# EAGLE design LCD ctrl (EAGLE 9.2.2)

## Sheet 1 of 2
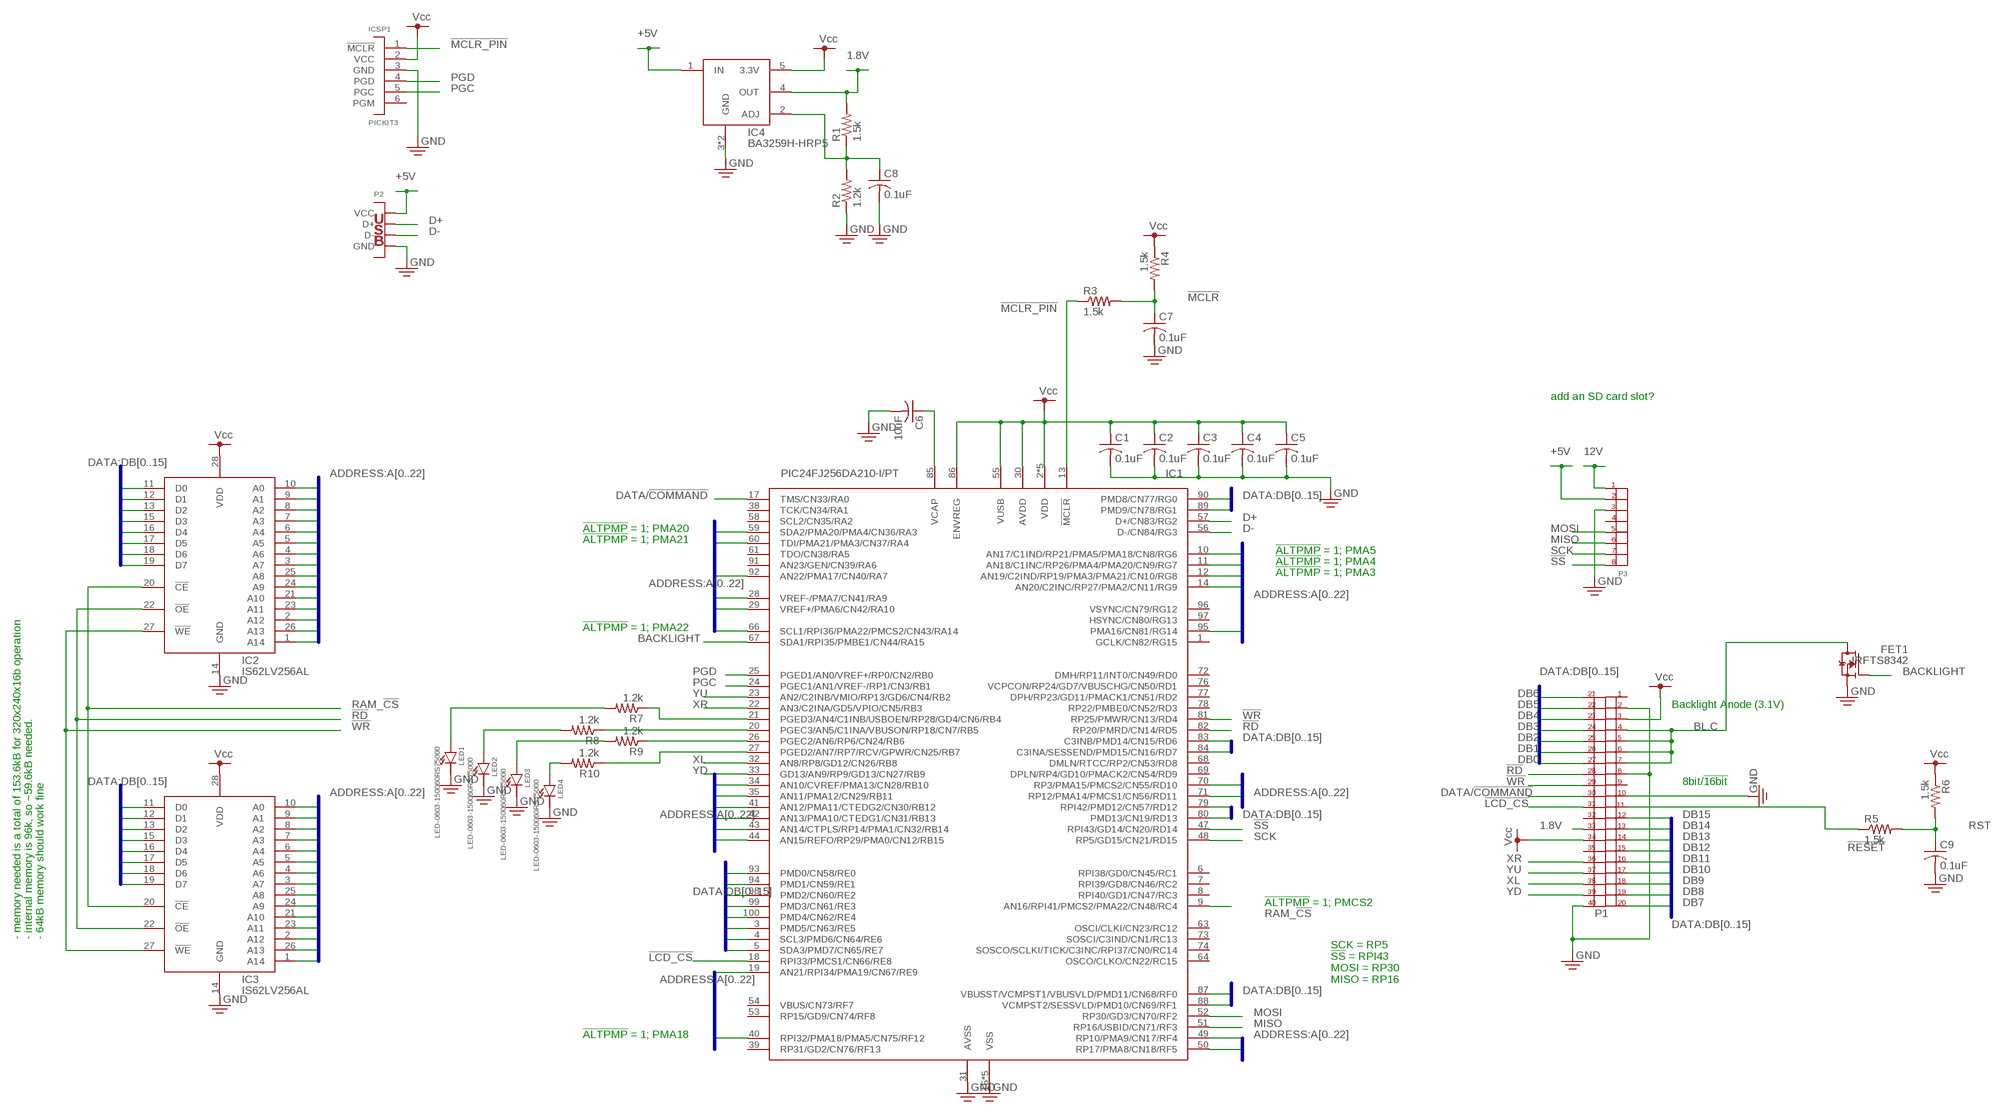
[diagram p0: schematic, sheet 1]

### Parts
C1  0.1uF  C-USC0603  [C0603]
C2  0.1uF  C-USC0603  [C0603]
C3  0.1uF  C-USC0603  [C0603]
C4  0.1uF  C-USC0603  [C0603]
C5  0.1uF  C-USC0603  [C0603]
C6  10uF  C-USC1206  [C1206]
C7  0.1uF  C-USC0603  [C0603]
C8  0.1uF  C-USC0603  [C0603]
C9  0.1uF  C-USC0603  [C0603]
FET1  IRFTS8342  [SOT23-6]
IC1  PIC24FJ256DA210-I/PT  [100-TQFP(0.4MM)]
IC2  IS62LV256AL  [28-SOIC]
IC3  IS62LV256AL  [28-SOIC]
IC4  BA3259H-HRP5  [HRP5]
ICSP1  PICKIT3  [PICKIT3]
LED1  LED-0603-150060RS75000  [0603-LED]
LED2  LED-0603-150060RS75000  [0603-LED]
LED3  LED-0603-150060RS75000  [0603-LED]
LED4  LED-0603-150060RS75000  [0603-LED]
P1  CONN-40P-62684-401100ALF  [62684-401100ALF]
P2  USB-CON690-005-299-043  [USB-CON(690-005-299-043)]
P3  CONN-8P-PND  [B08B-PND]
R1  1.5k  R-US_R0603  [R0603]
R2  1.2k  R-US_R0603  [R0603]
R3  1.5k  R-US_R0603  [R0603]
R4  1.5k  R-US_R0603  [R0603]
R5  1.5k  R-US_R0603  [R0603]
R6  1.5k  R-US_R0603  [R0603]
R7  1.2k  R-US_R0603  [R0603]
R8  1.2k  R-US_R0603  [R0603]
R9  1.2k  R-US_R0603  [R0603]
R10  1.2k  R-US_R0603  [R0603]

### Nets
1.8V: IC4.4(OUT) P1.33 R1.2
12V: P3.1
!LCD_CS: IC1.18(RPI33/PMCS1/CN66/RE8) P1.31
!MCLR: C7.1 R3.2 R4.2
!MCLR_PIN: IC1.13(!MCLR) ICSP1.1(!MCLR) R3.1
!RD: IC1.82(RP20/PMRD/CN14/RD5) IC2.22(!OE) IC3.22(!OE) P1.28
!RESET: P1.11 R5.1
!SS: IC1.47(RPI43/GD14/CN20/RD14) P3.8
!WR: IC1.81(RP25/PMWR/CN13/RD4) IC2.27(!WE) IC3.27(!WE) P1.29
+5V [Vcc]: IC4.1(IN) P2.1(VCC) P3.2
A0: IC1.44(AN15/REFO/RP29/PMA0/CN12/RB15) IC2.10(A0) IC3.10(A0)
A1: IC1.43(AN14/CTPLS/RP14/PMA1/CN32/RB14) IC2.9(A1) IC3.9(A1)
A2: IC1.14(AN20/C2INC/RP27/PMA2/CN11/RG9) IC2.8(A2) IC3.8(A2)
A3: IC1.12(AN19/C2IND/RP19/PMA3/PMA21/CN10/RG8) IC2.7(A3) IC3.7(A3)
A4: IC1.11(AN18/C1INC/RP26/PMA4/PMA20/CN9/RG7) IC2.6(A4) IC3.6(A4)
A5: IC1.10(AN17/C1IND/RP21/PMA5/PMA18/CN8/RG6) IC2.5(A5) IC3.5(A5)
A6: IC1.29(VREF+/PMA6/CN42/RA10) IC2.4(A6) IC3.4(A6)
A7: IC1.28(VREF-/PMA7/CN41/RA9) IC2.3(A7) IC3.3(A7)
A8: IC1.50(RP17/PMA8/CN18/RF5) IC2.25(A8) IC3.25(A8)
A9: IC1.49(RP10/PMA9/CN17/RF4) IC2.24(A9) IC3.24(A9)
A10: IC1.42(AN13/PMA10/CTEDG1/CN31/RB13) IC2.21(A10) IC3.21(A10)
A11: IC1.41(AN12/PMA11/CTEDG2/CN30/RB12) IC2.23(A11) IC3.23(A11)
A12: IC1.35(AN11/PMA12/CN29/RB11) IC2.2(A12) IC3.2(A12)
A13: IC1.34(AN10/CVREF/PMA13/CN28/RB10) IC2.26(A13) IC3.26(A13)
A14: IC1.71(RP12/PMA14/PMCS1/CN56/RD11) IC2.1(A14) IC3.1(A14)
A15: IC1.70(RP3/PMA15/PMCS2/CN55/RD10)
A16: IC1.95(PMA16/CN81/RG14)
A17: IC1.92(AN22/PMA17/CN40/RA7)
A18: IC1.40(RPI32/PMA18/PMA5/CN75/RF12)
A19: IC1.19(AN21/RPI34/PMA19/CN67/RE9)
A20: IC1.59(SDA2/PMA20/PMA4/CN36/RA3)
A21: IC1.60(TDI/PMA21/PMA3/CN37/RA4)
A22: IC1.66(SCL1/RPI36/PMA22/PMCS2/CN43/RA14)
BACKLIGHT: FET1.3(G) IC1.67(SDA1/RPI35/PMBE1/CN44/RA15)
BL.C: FET1.1(D) FET1.2(D) FET1.5(D) FET1.6(D) P1.4 P1.5 P1.6 P1.7
D+: IC1.57(D+/CN83/RG2) P2.3(D+)
D-: IC1.56(D-/CN84/RG3) P2.2(D-)
DATA/!COMMAND: IC1.17(TMS/CN33/RA0) P1.30
DB0: IC1.93(PMD0/CN58/RE0) IC3.11(D0) P1.27
DB1: IC1.94(PMD1/CN59/RE1) IC3.12(D1) P1.26
DB2: IC1.98(PMD2/CN60/RE2) IC3.13(D2) P1.25
DB3: IC1.99(PMD3/CN61/RE3) IC3.15(D3) P1.24
DB4: IC1.100(PMD4/CN62/RE4) IC3.16(D4) P1.23
DB5: IC1.3(PMD5/CN63/RE5) IC3.17(D5) P1.22
DB6: IC1.4(SCL3/PMD6/CN64/RE6) IC3.18(D6) P1.21
DB7: IC1.5(SDA3/PMD7/CN65/RE7) IC3.19(D7) P1.20
DB8: IC1.90(PMD8/CN77/RG0) IC2.11(D0) P1.19
DB9: IC1.89(PMD9/CN78/RG1) IC2.12(D1) P1.18
DB10: IC1.88(VCMPST2/SESSVLD/PMD10/CN69/RF1) IC2.13(D2) P1.17
DB11: IC1.87(VBUSST/VCMPST1/VBUSVLD/PMD11/CN68/RF0) IC2.15(D3) P1.16
DB12: IC1.79(RPI42/PMD12/CN57/RD12) IC2.16(D4) P1.15
DB13: IC1.80(PMD13/CN19/RD13) IC2.17(D5) P1.14
DB14: IC1.83(C3INB/PMD14/CN15/RD6) IC2.18(D6) P1.13
DB15: IC1.84(C3INA/SESSEND/PMD15/CN16/RD7) IC2.19(D7) P1.12
GND: C1.2 C2.2 C3.2 C4.2 C5.2 C6.2 C7.2 C8.2 C9.2 FET1.4(S) IC1.15(VSS) IC1.31(AVSS) IC1.36(VSS) IC1.45(VSS) IC1.65(VSS) IC1.75(VSS) IC2.14(GND) IC3.14(GND) IC4.3(GND) IC4.FIN(GND) ICSP1.3(GND) LED1.C LED2.C LED3.C LED4.C P1.2 P1.8 P1.10 P1.40 P2.5(GND) P2./GND1(GND) P2./GND(GND) P2.GND P2.GND1(GND) P3.3 R2.1
MISO: IC1.51(RP16/USBID/CN71/RF3) P3.6
MOSI: IC1.52(RP30/GD3/CN70/RF2) P3.5
N$1: C8.1 IC4.2(ADJ) R1.1 R2.2
N$2: IC1.21(PGED3/AN4/C1INB/USBOEN/RP28/GD4/CN6/RB4) R7.1
N$4: IC1.20(PGEC3/AN5/C1INA/VBUSON/RP18/CN7/RB5) R8.1
N$5: C6.1 IC1.85(VCAP)
N$6: IC1.26(PGEC2/AN6/RP6/CN24/RB6) R9.1
N$7: IC1.27(PGED2/AN7/RP7/RCV/GPWR/CN25/RB7) R10.1
N$8: LED4.A R10.2
N$9: LED3.A R9.2
N$10: LED2.A R8.2
N$11: LED1.A R7.2
PGC: IC1.24(PGEC1/AN1/VREF-/RP1/CN3/RB1) ICSP1.5(PGC)
PGD: IC1.25(PGED1/AN0/VREF+/RP0/CN2/RB0) ICSP1.4(PGD)
RAM_!CS: IC1.9(AN16/RPI41/PMCS2/PMA22/CN48/RC4) IC2.20(!CE) IC3.20(!CE)
RST: C9.1 R5.2 R6.2
SCK: IC1.48(RP5/GD15/CN21/RD15) P3.7
VCC: C1.1 C2.1 C3.1 C4.1 C5.1 IC1.2(VDD) IC1.16(VDD) IC1.30(AVDD) IC1.37(VDD) IC1.46(VDD) IC1.55(VUSB) IC1.62(VDD) IC1.86(ENVREG) IC2.28(VDD) IC3.28(VDD) IC4.5(3.3V) ICSP1.2(VCC) P1.3 P1.34 R4.1 R6.1
XL: IC1.32(AN8/RP8/GD12/CN26/RB8) P1.38
XR: IC1.22(AN3/C2INA/GD5/VPIO/CN5/RB3) P1.36
YD: IC1.33(GD13/AN9/RP9/GD13/CN27/RB9) P1.39
YU: IC1.23(AN2/C2INB/VMIO/RP13/GD6/CN4/RB2) P1.37
Unconnected: IC1.1(GCLK/CN82/RG15) IC1.6(RPI38/GD0/CN45/RC1) IC1.7(RPI39/GD8/CN46/RC2) IC1.8(RPI40/GD1/CN47/RC3) IC1.38(TCK/CN34/RA1) IC1.39(RP31/GD2/CN76/RF13) IC1.53(RP15/GD9/CN74/RF8) IC1.54(VBUS/CN73/RF7) IC1.58(SCL2/CN35/RA2) IC1.61(TDO/CN38/RA5) IC1.63(OSCI/CLKI/CN23/RC12) IC1.64(OSCO/CLKO/CN22/RC15) IC1.68(DMLN/RTCC/RP2/CN53/RD8) IC1.69(DPLN/RP4/GD10/PMACK2/CN54/RD9) IC1.72(DMH/RP11/INT0/CN49/RD0) IC1.73(SOSCI/C3IND/CN1/RC13) IC1.74(SOSCO/SCLKI/TICK/C3INC/RPI37/CN0/RC14) IC1.76(VCPCON/RP24/GD7/VBUSCHG/CN50/RD1) IC1.77(DPH/RP23/GD11/PMACK1/CN51/RD2) IC1.78(RP22/PMBE0/CN52/RD3) IC1.91(AN23/GEN/CN39/RA6) IC1.96(VSYNC/CN79/RG12) IC1.97(HSYNC/CN80/RG13) ICSP1.6(PGM) P1.1 P1.9 P1.32 P1.35 P3.4

### Buses
DATA:DB[0..15]
ADDRESS:A[0..22]

### Notes on the sheet
- add an SD card slot?
- !ALTPMP! = 1; PMA20
- !ALTPMP! = 1; PMA21
- !ALTPMP! = 1; PMA5
- !ALTPMP! = 1; PMA4
- !ALTPMP! = 1; PMA3
- !ALTPMP! = 1; PMA22
- Backlight Anode (3.1V)
- 8bit/!16bit!
- !ALTPMP! = 1; PMCS2
- - memory needed is a total of 153.6kB for 320x240x16b operation
  - internal memory is 96k, so ~59.6kB needed.
  - 64kB memory should work fine
- SCK = RP5
  !SS! = RPI43
  MOSI = RP30
  MISO = RP16
- !ALTPMP! = 1; PMA18

## Sheet 2 of 2

## Library data of the parts
C1-C9 = rcl:C-US: CAPACITOR, American symbol
FET1 = Aaron SMT:IRFTS8342
IC1 = Aaron SMT:PIC24FJ256DA210
IC2 IC3 = Aaron SMT:IS62LV256AL: 32k x 8b SRAM (256kb) IS62LV = 3.3V IS62C = 5.0V
IC4 = Aaron SMT:BA3259H: 3.3V + adj. regulator, < 1.0A output
ICSP1 = Aaron:PICKIT3
LED1-LED4 = Aaron SMT:LED-0603: red 0603 LED
P1 = Aaron SMT:CONN-40P
P2 = Aaron SMT:USB-CON
P3 = Aaron:CONN-8P
R1-R10 = rcl:R-US_: RESISTOR, American symbol

## Net classes
0 default: width 0.2 mm, drill 0.5 mm, clearance 0.2 mm
1 Vcc: width 0.5 mm, drill 0.5 mm, clearance 0.2 mm
2 0.25mm: width 0.25 mm, drill 0.5 mm, clearance 0.25 mm

## Board
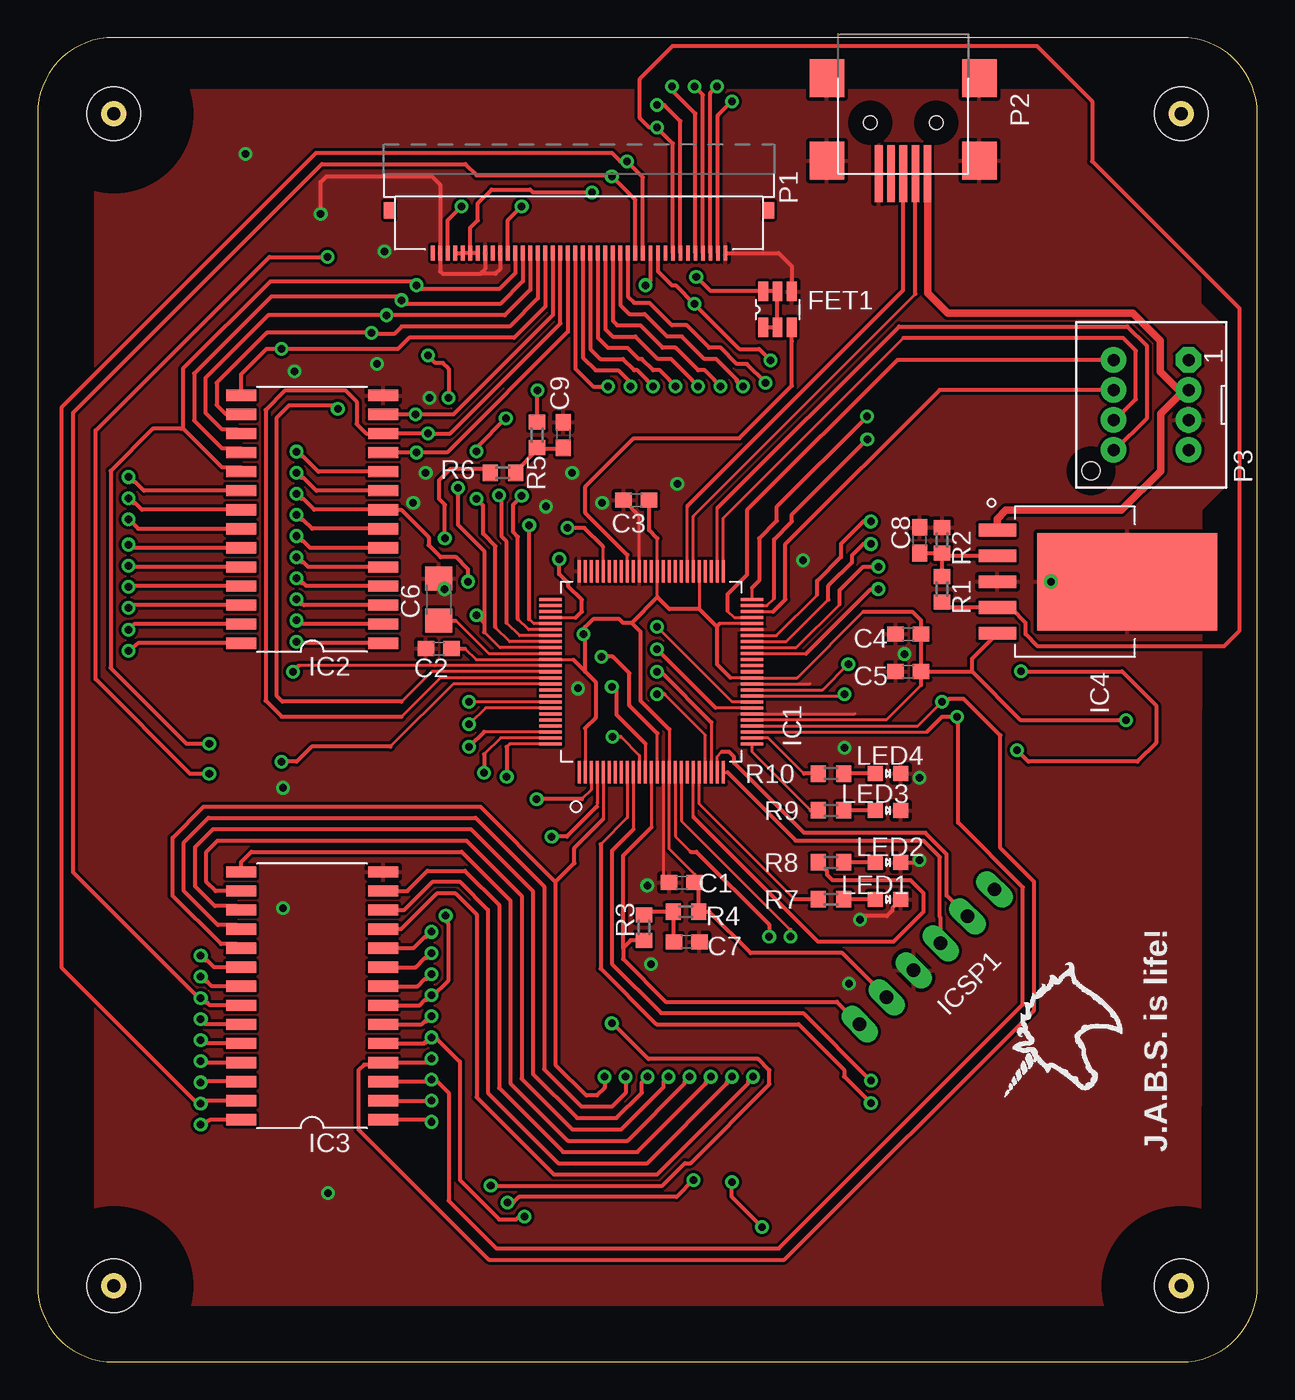
[diagram p1: board, top side]
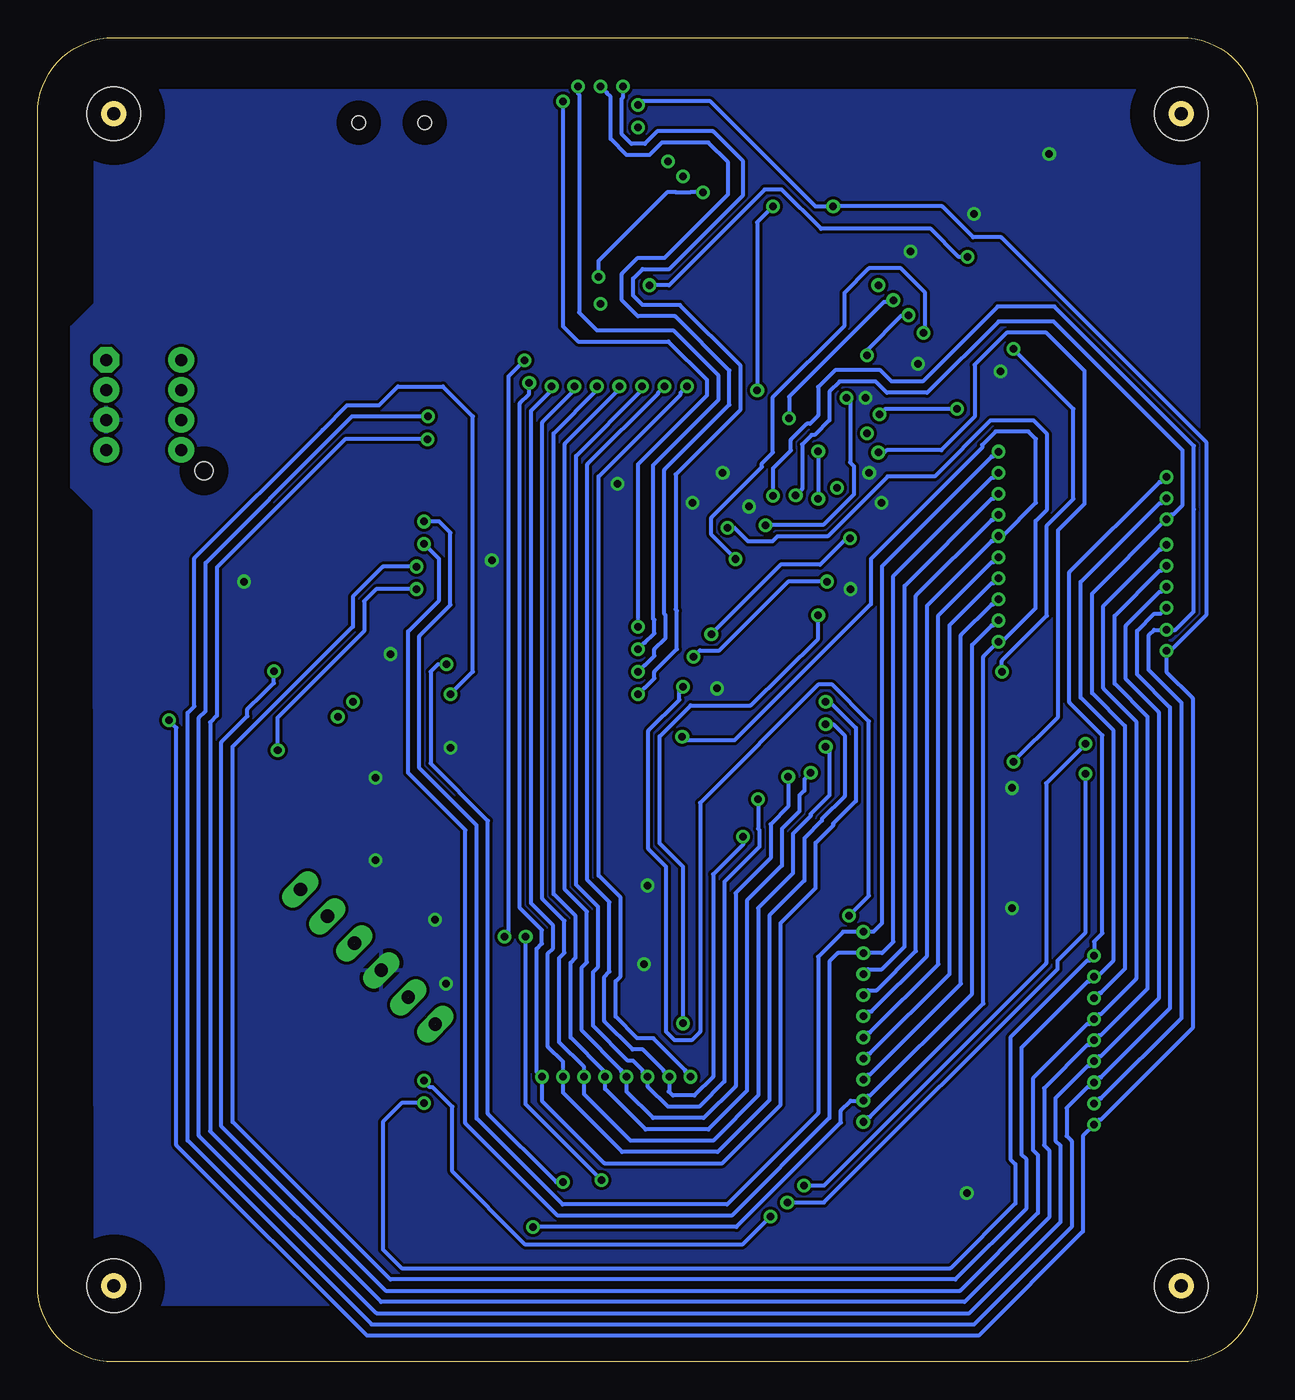
[diagram p2: board, bottom side, seen from below]

Size 81.25 x 88.25 mm. Coordinates in mm from the lower left corner, seen from the top.
Outline: 5.08,0 76.17,0 arc90 81.25,5.08 81.25,83.17 arc90 76.17,88.25 5.08,88.25 arc90 0,83.17 0,5.08 arc90 5.08,0
Copper layers (1*16): Top 0.035mm / dielectric 1.5mm / Bottom 0.035mm
Design rules "default *": minimum track width 6mil, minimum drill 0.35mm, track to track 6.5mil, track to pad 6.5mil, pad to pad 6.5mil, via to via 6.5mil, smd to smd 6mil, copper to edge 40mil, drill to drill 6mil, minimum pad ring 10mil, minimum via ring 8mil, stop-mask expansion 4mil, vias tented up to drill 0mil, thermal gap 10mil

### Footprints (pad centres in the part's own frame; a part is rotated, then mirrored left to right if it is on the bottom)
C0603 = smd 1.1 x 1: 1 -0.85,0; 2 0.85,0
C1206 = smd 1.6 x 1.8: 1 -1.4,0; 2 1.4,0
SOT23-6 = smd 0.65 x 1.3: 1 -0.95,-1.2; 2 0,-1.2; 3 0.95,-1.2; 4 0.95,1.2; 5 0,1.2; 6 -0.95,1.2
100-TQFP(0.4MM) = smd 1.5 x 0.2: 1 -6.7,4.8; 2 -6.7,4.4; 3 -6.7,4; 4 -6.7,3.6; 5 -6.7,3.2; 6 -6.7,2.8; 7 -6.7,2.4; 8 -6.7,2; 9 -6.7,1.6; 10 -6.7,1.2; 11 -6.7,0.8; 12 -6.7,0.4; 13 -6.7,0; 14 -6.7,-0.4; 15 -6.7,-0.8; 16 -6.7,-1.2; 17 -6.7,-1.6; 18 -6.7,-2; 19 -6.7,-2.4; 20 -6.7,-2.8; 21 -6.7,-3.2; 22 -6.7,-3.6; 23 -6.7,-4; 24 -6.7,-4.4; 25 -6.7,-4.8; 51 6.7,-4.8; 52 6.7,-4.4; 53 6.7,-4; 54 6.7,-3.6; 55 6.7,-3.2; 56 6.7,-2.8; 57 6.7,-2.4; 58 6.7,-2; 59 6.7,-1.6; 60 6.7,-1.2; 61 6.7,-0.8; 62 6.7,-0.4; 63 6.7,0; 64 6.7,0.4; 65 6.7,0.8; 66 6.7,1.2; 67 6.7,1.6; 68 6.7,2; 69 6.7,2.4; 70 6.7,2.8; 71 6.7,3.2; 72 6.7,3.6; 73 6.7,4; 74 6.7,4.4; 75 6.7,4.8 | smd 0.2 x 1.5: 26 -4.8,-6.7; 27 -4.4,-6.7; 28 -4,-6.7; 29 -3.6,-6.7; 30 -3.2,-6.7; 31 -2.8,-6.7; 32 -2.4,-6.7; 33 -2,-6.7; 34 -1.6,-6.7; 35 -1.2,-6.7; 36 -0.8,-6.7; 37 -0.4,-6.7; 38 0,-6.7; 39 0.4,-6.7; 40 0.8,-6.7; 41 1.2,-6.7; 42 1.6,-6.7; 43 2,-6.7; 44 2.4,-6.7; 45 2.8,-6.7; 46 3.2,-6.7; 47 3.6,-6.7; 48 4,-6.7; 49 4.4,-6.7; 50 4.8,-6.7; 76 4.8,6.7; 77 4.4,6.7; 78 4,6.7; 79 3.6,6.7; 80 3.2,6.7; 81 2.8,6.7; 82 2.4,6.7; 83 2,6.7; 84 1.6,6.7; 85 1.2,6.7; 86 0.8,6.7; 87 0.4,6.7; 88 0,6.7; 89 -0.4,6.7; 90 -0.8,6.7; 91 -1.2,6.7; 92 -1.6,6.7; 93 -2,6.7; 94 -2.4,6.7; 95 -2.8,6.7; 96 -3.2,6.7; 97 -3.6,6.7; 98 -4,6.7; 99 -4.4,6.7; 100 -4.8,6.7
28-SOIC = smd 2 x 0.75: 1 -4.729,8.255; 2 -4.729,6.985; 3 -4.729,5.715; 4 -4.729,4.445; 5 -4.729,3.175; 6 -4.729,1.905; 7 -4.729,0.635; 8 -4.729,-0.635; 9 -4.729,-1.905; 10 -4.729,-3.175; 11 -4.729,-4.445; 12 -4.729,-5.715; 13 -4.729,-6.985; 14 -4.729,-8.255; 15 4.729,-8.255; 16 4.729,-6.985; 17 4.729,-5.715; 18 4.729,-4.445; 19 4.729,-3.175; 20 4.729,-1.905; 21 4.729,-0.635; 22 4.729,0.635; 23 4.729,1.905; 24 4.729,3.175; 25 4.729,4.445; 26 4.729,5.715; 27 4.729,6.985; 28 4.729,8.255
HRP5 = smd 0.85 x 2.5: 1 -3.44,-5.16; 2 -1.72,-5.16; 3 0,-5.16; 4 1.72,-5.16; 5 3.44,-5.16 | smd 6.5 x 12: FIN 0,3.5
PICKIT3 = drill 0.889 pad 1.422 long: 1 -6.35,0; 2 -3.81,0; 3 -1.27,0; 4 1.27,0; 5 3.81,0; 6 6.35,0
0603-LED = smd 1 x 1: A -0.85,0; C 0.85,0
62684-401100ALF = smd 0.25 x 1: 1 9.75,2.5; 2 9.25,2.5; 3 8.75,2.5; 4 8.25,2.5; 5 7.75,2.5; 6 7.25,2.5; 7 6.75,2.5; 8 6.25,2.5; 9 5.75,2.5; 10 5.25,2.5; 11 4.75,2.5; 12 4.25,2.5; 13 3.75,2.5; 14 3.25,2.5; 15 2.75,2.5; 16 2.25,2.5; 17 1.75,2.5; 18 1.25,2.5; 19 0.75,2.5; 20 0.25,2.5; 21 -0.25,2.5; 22 -0.75,2.5; 23 -1.25,2.5; 24 -1.75,2.5; 25 -2.25,2.5; 26 -2.75,2.5; 27 -3.25,2.5; 28 -3.75,2.5; 29 -4.25,2.5; 30 -4.75,2.5; 31 -5.25,2.5; 32 -5.75,2.5; 33 -6.25,2.5; 34 -6.75,2.5; 35 -7.25,2.5; 36 -7.75,2.5; 37 -8.25,2.5; 38 -8.75,2.5; 39 -9.25,2.5; 40 -9.75,2.5 | smd 0.7 x 1.1: M1 12.65,-0.35; M2 -12.65,-0.35
USB-CON(690-005-299-043) = smd 0.508 x 3.81: 1 -1.626,6.35; 2 -0.813,6.35; 3 0,6.35; 4 0.813,6.35; 5 1.626,6.35 | smd 2.286 x 2.54: /GND -5.08,0; /GND1 5.08,0; GND -5.08,5.486; GND1 5.08,5.486 | hole 0.9: -2.21,2.946; 2.21,2.946
B08B-PND = drill 0.8 pad 1.714 octagon: 1 3,-2.5 | drill 0.8 pad 1.714: 2 1,-2.5; 3 -1,-2.5; 4 -3,-2.5; 5 -3,2.5; 6 -1,2.5; 7 1,2.5; 8 3,2.5 | hole 1.2: -4.4,4
R0603 = smd 1 x 1.1: 1 -0.85,0; 2 0.85,0
#6-32 = hole 3.556: 0,0

### Placement (x,y rotation side)
C1  42.92,31.95 180 top
C2  26.72,47.53 180 top
C3  39.88,57.42 180 top
C4  58,48.5 180 top
C5  58,46 180 top
C6  26.72,50.8 90 top
C7  43.23,28 0 top
C8  58.75,54.75 90 top
C9  35.03,61.77 90 top
FET1  49.29,70.13 0 top
IC1  40.88,45.99 90 top
IC2  18.29,56.15 180 top
IC3  18.29,24.4 180 top
IC4  69.09,51.99 270 top
ICSP1  59.25,27 45 top
LED1  56.66,30.83 0 top
LED2  56.66,33.29 0 top
LED3  56.66,36.75 0 top
LED4  56.66,39.21 0 top
P1  36.07,76.39 180 top
P2  57.66,85.53 180 top
P3  74.17,63.77 90 top
R1  60.25,51.5 270 top
R2  60.25,54.75 270 top
R3  40.39,28.94 90 top
R4  43.18,30 180 top
R5  33.28,61.77 270 top
R6  30.99,59.25 0 top
R7  52.85,30.83 0 top
R8  52.85,33.29 0 top
R9  52.85,36.75 0 top
R10  52.85,39.21 0 top
U$20  [UNICORN-SCREEN]  68.25,22 90 top
U$32  [#6-32]  5.08,83.17 90 top
U$33  [#6-32]  5.08,5.08 90 top
U$34  [#6-32]  76.17,5.08 90 top
U$35  [#6-32]  76.17,83.17 90 top
U$36  [JABS]  75.25,14 90 top

### Tracks (layer width: path | path; a pad name or v marks a point on that pad's centre or on a via)
1.8V  (via drill 0.5)
  Top 0.25: R1.2 60.63,50.27 IC4.4 63.94,50.19 64.88,50.19 65.81,49.25 65.81,48.5 66.62,47.69 79,47.69 80.06,48.75 80.06,70.19 70.25,80 70.25,84 66.56,87.69 42.31,87.69 40.12,85.5 40.12,82.88 40.75,82.25 v41.25,82.25 42.32,81.18 P1.33
!LCD_CS  (via drill 0.5)
  Top 0.2: IC1.18 42.88,36.06 50.14,28.8
  Top 0.25: P1.31 41.32,72.68 42.25,71.75 42.5,71.75 v43.75,70.5 46.75,67.5 48.06,67.5 v48.81,66.75 | 50.14,28.8 v50.14,28.33
  Bottom 0.25: v48.81,66.75 49.88,65.69 49.88,28.62 50.06,28.44 v50.14,28.33
!MCLR
  Top 0.25: C7.1 42.38,29.95 R4.2 40.6,30 R3.2
!MCLR_PIN  (1 unrouted)
  Top 0.2: IC1.13 40.88,35.63
  Top 0.25: ICSP1.1 54.74,22.51 53.25,24 41.84,24 39,26.84 39,27.58 | 40.88,35.63 39,33.75 39,27.58 | R3.1 39.51,28.09 39,27.58
!RD  (via drill 0.5)
  Top 0.2: IC1.82 32.11,48.39 31.25,49.25
  Top 0.25: IC2.22 6.69,55.52 v6.06,56.15 | IC3.22 11.48,23.77 11.32,23.93 11.2,23.93 v10.87,24.25 10.69,24.31 2.38,32.62 2.38,63.25 18.94,79.81 28.5,79.81 29.25,79.06 38.25,79.06 v38.25,79 39.82,77.43 P1.28 | v30.75,57.75 30.92,57.58 30.92,54.99 31.25,54.66 31.25,49.25
  Bottom 0.25: v10.87,24.25 10.53,24.59 10.42,24.59 8.82,26.19 8.82,42.38 11.02,44.57 11.02,51.19 v6.06,56.15 5.73,56.48 5.61,56.48 4.98,57.11 4.98,60.73 13.58,69.33 17.24,69.33 21.99,64.58 24.68,64.58 25.43,65.33 27.82,65.33 28.5,64.65 28.5,62.75 29.48,61.77 29.7,61.77 30.33,61.13 30.33,58.17 v30.75,57.75
!RESET  (via drill 0.5)
  Top 0.25: P1.11 31.32,76.07 v32.25,77 | R5.1 33.28,64.72 v33.31,64.75
  Bottom 0.25: v33.31,64.75 33.31,75.94 v32.25,77
!SS
  Top 0.2: IC1.47 46.41,49.59 45.95,50.05
  Top 0.25: P3.8 57.27,66.77 47.25,56.75 47.25,52.44 45.95,51.15 45.95,50.05
!WR  (via drill 0.5)
  Top 0.2: IC1.81 32.71,48.79 32,49.5
  Top 0.25: IC2.27 6.44,49.16 v6.06,48.78 | IC3.27 11.06,17.41 v10.87,17.22 10.69,17.19 1.62,26.25 1.62,63.62 18.56,80.56 38.25,80.56 38.81,80 v39.25,80 40.32,78.93 P1.29 | 32,49.5 32,54.98 31.67,55.3 31.67,57.12 v32.25,57.7
  Bottom 0.25: v10.87,17.22 10.54,17.55 10.42,17.55 5.07,22.9 5.07,43.93 7.26,46.12 7.26,48.4 6.88,48.78 v6.06,48.78 5.46,48.78 4.25,50 4.25,56.78 4.23,56.8 4.23,61.04 13.52,70.33 17.3,70.33 22.3,65.33 24.37,65.33 25.12,66.08 28.13,66.08 29.25,64.96 29.25,63.06 29.8,62.52 30.01,62.52 31.08,61.45 31.08,60.73 32.25,59.56 v32.25,57.7
+5V
  Top 0.5: IC4.1 63.93,56.18 64.5,56.75 72.19,56.75 74.81,59.37 74.81,63.19 76,64.38 76.28,64.38 P3.2 76.01,64.77 74.78,66 74.78,68.06 72.96,69.88 60.62,69.88 59.29,71.21 P2.1
A0  (via drill 0.5)
  Top 0.2: IC1.44 49.21,48.39 51.92,51.1
  Top 0.25: v26.25,28.66 25.92,28.33 25.8,28.33 25.05,27.57 IC3.10 | v17.25,60.66 17.58,60.33 17.7,60.33 18.7,59.33 IC2.10 | v55.5,56 55,56 53.5,54.5 53.5,53.62 51.92,52.04 51.92,51.1
  Bottom 0.25: v17.25,60.66 17.58,60.33 17.7,60.33 25,53.03 25,29.25 25.59,28.66 v26.25,28.66 27.59,28.66 29.25,27 29.25,16.57 35.33,10.5 46.27,10.5 52,16.23 52,35.75 55.82,39.57 55.82,48.37 53.75,50.44 53.75,55.25 54.5,56 v55.5,56
A1  (via drill 0.5)
  Top 0.2: IC1.43 49.87,47.99 52.67,50.79
  Top 0.25: IC3.9 25.18,26.3 25.8,26.92 25.92,26.92 v26.25,27.25 | v17.25,59.25 17.58,58.92 17.7,58.92 18.57,58.05 IC2.9 | 52.67,50.79 52.67,51.73 54.25,53.31 54.25,53.75 55,54.5 v55.5,54.5
  Bottom 0.25: v17.25,59.25 17.58,58.92 17.7,58.92 24.25,52.37 24.25,28 25,27.25 v26.25,27.25 27.94,27.25 28.5,26.69 28.5,16.27 35.02,9.75 46.59,9.75 52.75,15.91 52.75,35.44 56.57,39.26 56.57,48.68 54.5,50.75 54.5,53.5 v55.5,54.5
A2  (via drill 0.5)
  Top 0.2: IC1.14 41.28,41.88
  Top 0.25: IC3.8 25.32,25.04 25.8,25.52 25.92,25.52 v26.25,25.84 | v17.25,57.84 17.58,57.52 17.7,57.52 18.43,56.78 IC2.8 24.21,56.78 26.05,54.95 26.05,54.43 26.85,53.62 27.88,53.62 28.67,52.83 v28.67,52 | v37.56,47 38.31,47 39.42,45.89 39.42,43.74 41.28,41.88
  Bottom 0.25: v26.25,25.84 25.92,26.17 25.02,26.17 23.5,27.69 23.5,51.71 17.7,57.52 17.58,57.52 v17.25,57.84 | v28.67,52 31.25,52 35.83,47.42 37.14,47.42 v37.56,47
A3  (via drill 0.5)
  Top 0.2: 40.48,41.21 IC1.12
  Top 0.25: IC3.7 25.46,23.77 25.8,24.11 25.92,24.11 v26.25,24.44 26.25,24.31 27.38,25.44 27.38,29.19 27.19,29.38 v27.19,29.75 | IC2.7 18.29,55.52 17.7,56.11 17.58,56.11 v17.25,56.44 | v38.25,45 38.56,44.69 38.56,43.13 40.48,41.21
  Bottom 0.25: v26.25,24.44 25.92,24.77 25.36,24.77 22.75,27.38 22.75,51.06 17.7,56.11 17.58,56.11 v17.25,56.44 | v27.19,29.75 25.88,31.06 25.88,42.69 28.31,45.12 29.25,45.12 37.12,37.25 37.12,22 37.69,21.44 38.81,21.44 39.38,22 39.38,33 40.56,34.19 40.56,42.06 38.5,44.12 38.5,44.75 v38.25,45
A4  (via drill 0.5)
  Top 0.2: IC1.11 40.08,40.42 38.83,41.67
  Top 0.25: IC3.6 25.59,22.5 25.8,22.7 25.92,22.7 v26.25,23.03 | IC2.6 18.16,54.24 17.7,54.7 17.58,54.7 v17.25,55.03 | v38.31,41.67 38.83,41.67
  Bottom 0.25: v26.25,23.03 25.92,23.36 25.71,23.36 22,27.07 22,50.4 17.7,54.7 17.58,54.7 v17.25,55.03 16.97,55.03 14.75,57.25 14.75,61.5 15.25,62 17.43,62 18.33,61.1 18.33,60.92 25.75,53.5 25.75,50.5 34.83,41.42 38.06,41.42 v38.31,41.67
A5  (via drill 0.5)
  Top 0.2: IC1.10 39.68,35.49
  Top 0.25: IC3.5 25.73,21.23 25.8,21.3 25.92,21.3 v26.25,21.63 26.25,21.5 26.62,21.5 28.12,20 28.12,12.12 30.75,9.5 31.88,9.5 32.06,9.69 v32.44,9.69 | IC2.5 18.02,52.98 17.7,53.3 17.58,53.3 v17.25,53.63 | v55.51,18.74 51,23.25 41.53,23.25 38.25,26.53 38.25,34.06 39.68,35.49
  Bottom 0.25: v26.25,21.63 25.92,21.95 25.8,21.95 21.25,26.51 21.25,49.74 17.7,53.3 17.58,53.3 v17.25,53.63 | v32.44,9.69 34.31,7.81 48.75,7.81 53.62,12.69 53.62,17 54.94,18.31 55.12,18.31 55.5,18.69 v55.51,18.74
A6  (via drill 0.5)
  Top 0.2: IC1.29 58.64,42.39 v60.25,44
  Top 0.25: v26.25,20.22 25.99,19.95 IC3.4 22.88,19.81 21.75,19.81 21.38,19.44 21.38,15.5 30.06,6.81 49.75,6.81 66.38,23.44 66.38,32 64.12,34.25 64.12,41.75 61.69,44.19 60.75,44.19 60.56,44 v60.25,44 | IC2.4 17.88,51.7 17.7,51.89 17.58,51.89 v17.25,52.22
  Bottom 0.25: v26.25,20.22 25.92,20.55 25.8,20.55 20.5,25.85 20.5,49.09 17.7,51.89 17.58,51.89 v17.25,52.22
A7  (via drill 0.5)
  Top 0.2: IC1.28 59.24,41.99
  Top 0.25: IC3.3 26.12,18.68 v26.25,18.81 26.25,18.69 26.62,18.69 27.38,17.94 27.38,10.75 30.56,7.56 49.38,7.56 65.62,23.81 65.62,31.62 61.31,35.94 61.31,42.88 v61.25,43 60.25,43 59.24,41.99 | IC2.3 17.75,50.44 17.7,50.48 17.58,50.48 v17.25,50.81
  Bottom 0.25: v26.25,18.81 25.92,19.14 25.8,19.14 19.75,25.19 19.75,48.43 17.7,50.48 17.58,50.48 v17.25,50.81
A8  (via drill 0.5)
  Top 0.2: 47.58,51.58 IC1.50
  Top 0.25: IC2.25 6.12,51.7 v6.06,51.65 | IC3.25 10.95,19.95 v10.87,20.04 | 47.58,51.58 48.06,52.06 48.06,54.87 49.25,56.06 49.25,57 v55.25,63
  Bottom 0.25: v6.06,51.65 6.39,51.32 6.51,51.32 8.77,49.06 8.77,45.5 6.57,43.31 6.57,24.22 10.42,20.36 10.54,20.36 v10.87,20.04 11.2,19.71 11.32,19.71 13.45,17.58 13.45,14.75 13.12,14.42 13.12,9.31 19.18,3.25 58.68,3.25 70.5,15.07 70.5,42.93 70.06,43.37 70.06,53.25 61.52,61.79 | 61.52,61.79 | v55.25,63 60.31,63 61.52,61.79
A9  (via drill 0.5)
  Top 0.2: IC1.49 48.58,50.39 49.06,50.87
  Top 0.25: IC2.24 6.14,52.98 v6.06,53.06 | IC3.24 11.09,21.23 v10.87,21.44 | 49.06,50.87 49.06,54.81 50.25,56 50.25,56.46 v55.27,61.48
  Bottom 0.25: v6.06,53.06 6.39,52.73 6.51,52.73 9.52,49.72 9.52,45.19 7.32,43 7.32,24.87 10.42,21.77 10.54,21.77 v10.87,21.44 11.2,21.11 11.32,21.11 14.2,18.23 14.2,14.44 13.87,14.11 13.87,9.62 19.49,4 58.37,4 69.75,15.38 69.75,42.62 69.31,43.06 69.31,52.94 60.77,61.48 v55.27,61.48
A10  (via drill 0.5)
  Top 0.2: IC1.42 50.53,47.59 53.42,50.48
  Top 0.25: IC2.21 6.95,56.78 6.51,57.23 6.39,57.23 v6.06,57.56 | IC3.21 11.61,25.04 11.32,25.33 11.21,25.33 v10.87,25.67 | 53.42,50.48 53.42,51.42 55,53 v56,53
  Bottom 0.25: v6.06,57.56 6.39,57.23 6.51,57.23 11.77,51.97 11.77,44.26 9.57,42.07 9.57,26.77 10.67,25.67 v10.87,25.67 11.21,25.33 11.32,25.33 15.7,20.95 15.7,13.82 15.37,13.49 15.37,10.24 20.11,5.5 57.75,5.5 68.25,16 68.25,41 60.25,49 60.25,51 58.25,53 v56,53
A11  (via drill 0.5)
  Top 0.2: IC1.41 51.19,47.19
  Top 0.25: IC2.23 6.28,54.24 v6.06,54.46 | IC3.23 11.34,22.5 11.32,22.52 11.2,22.52 v10.87,22.85 | 51.19,47.19 55.5,51.5 v56,51.5 | v65.51,46.01 72.24,46.01 74.5,43.75 74.5,41.25 73.25,40 66,40 v65.25,40.75
  Bottom 0.25: v6.06,54.46 6.39,54.13 6.51,54.13 10.27,50.38 10.27,44.88 8.07,42.69 8.07,25.53 10.42,23.18 10.54,23.18 v10.87,22.85 11.2,22.52 11.32,22.52 14.95,18.89 14.95,14.13 14.62,13.8 14.62,9.93 19.8,4.75 58.06,4.75 69,15.69 69,41.31 67.28,43.03 67.28,43.49 66.25,44.5 65.51,45.24 v65.51,46.01 | v65.25,40.75 65.25,42.94 59.5,48.69 59.5,50.69 58.69,51.5 v56,51.5
A12  (via drill 0.5)
  Top 0.2: IC1.35 52.29,44.79 v54,46.5
  Top 0.25: IC3.2 v26.24,17.41 v26.25,17.41 | IC2.2 17.49,49.16 v17.25,49.41 | v48.25,9 46.25,11 v46.25,12
  Bottom 0.25: v17.25,49.41 17.58,49.08 17.7,49.08 19,47.77 19,24.54 25.8,17.73 25.92,17.73 v26.25,17.41 27.09,17.41 27.75,16.75 27.75,15.95 34.7,9 v48.25,9 | v46.25,12 46.71,12 51.25,16.54 51.25,36.06 55.07,39.88 55.07,46 54.57,46.5 v54,46.5
A13  (via drill 0.5)
  Top 0.2: IC1.34 53.64,44.39
  Top 0.25: IC2.26 6.25,50.44 v6.06,50.24 | IC3.26 10.93,18.68 v10.87,18.63 | 53.64,44.39 v53.75,44.5
  Bottom 0.25: v6.06,50.24 6.44,49.86 6.86,49.86 8.02,48.71 8.02,45.81 5.82,43.62 5.82,23.56 10.42,18.96 10.54,18.96 v10.87,18.63 11.2,18.3 11.32,18.3 12.7,16.92 12.7,15.06 12.37,14.73 12.37,9 18.87,2.5 58.99,2.5 71.25,14.76 71.25,43.25 70.81,43.69 70.81,53.56 62.27,62.1 | v53.75,44.5 52.25,46 52.25,63 54.25,65 57.25,65 58.5,63.75 60.62,63.75 62.27,62.1 | 62.27,62.1
A14  (via drill 0.5)
  Top 0.2: IC1.71 37.68,54.32
  Top 0.25: IC3.1 26.11,16.14 v26.25,16 | IC2.1 17.36,47.9 v17.25,48 | v35.3,55.57 36.43,55.57 37.68,54.32
  Bottom 0.25: v26.25,16 25.92,16.33 25.8,16.33 18.25,23.88 18.25,47 v17.25,48 17,48 14.77,50.23 14.77,56.05 14,56.81 14,61.81 14.94,62.75 17.74,62.75 21.49,59 24.63,59 28.63,55 31.98,55 32.3,54.67 33.92,54.67 34.82,55.57 v35.3,55.57
BACKLIGHT
  Top 0.2: IC1.67 39.28,53.78
  Top 0.25: 39.28,53.78 36.49,56.57 36.49,58.31 39.72,61.55 46.74,61.55 50.25,65.05 50.25,68 50.24,68.01 FET1.3
BL.C  (via drill 0.5)
  Top 0.25: P1.4 P1.5 P1.6 | P1.6 28.82,75.57 29.33,76.08 29.33,77.2 30.25,78.12 32.81,78.12 33,77.94 v36.94,77.94 | P1.7 P1.6 | 49.25,68.94 48.5,68.94 FET1.1 | 49.25,68.94 49.25,71.19 FET1.5 49.25,71.38 48.5,71.38 FET1.6 48.31,71.38 44.81,71.38 v43.88,72.31 | 49.25,68.94 FET1.2
  Bottom 0.25: v43.88,72.31 43.88,73.38 39.31,77.94 38.71,77.94 38.7,77.92 37.8,77.92 37.79,77.94 v36.94,77.94
D+
  Top 0.2: IC1.57 43.28,57.02
  Top 0.25: P2.3 57.66,71.4 43.28,57.02
D-
  Top 0.2: IC1.56 43.68,56.36 58.47,71.16
  Top 0.25: 58.47,71.16 P2.2
DATA/!COMMAND  (via drill 0.5)
  Top 0.2: IC1.17 42.48,35.02 43.5,34
  Top 0.25: 43.5,34 43.88,34 48.73,29.14 v48.73,28.33 | v19.31,73.62 15.44,73.62 3.88,62.06 3.88,45.5 10.19,39.19 v11.44,39.19 | v31.31,10.62 31.69,10.62 32.06,11 42.56,11 v43.69,12.12 | v40.5,71.75 40.82,72.07 P1.30
  Bottom 0.25: v40.5,71.75 39.19,71.75 32.81,78.12 31.69,78.12 29.06,75.5 21.75,75.5 19.88,73.62 v19.31,73.62 | v11.44,39.19 11.44,28.62 13.31,26.75 13.31,26.19 28.88,10.62 v31.31,10.62 | v43.69,12.12 48.75,17.19 48.75,28.25 v48.73,28.33
DB0  (via drill 0.5)
  Top 0.2: IC1.93 v28.76,43.99
  Top 0.25: IC3.11 24.22,28.84 26.59,31.22 27.85,31.22 29.25,29.82 29.25,17.64 34.39,12.5 41.27,12.5 47.33,18.55 47.33,18.67 v47.66,19 | v28.76,43.99 v28.75,44 | P1.27 39.32,71 39.74,70.58 40.75,70.58 42.25,69.08 43.23,69.08 44.73,67.58 45.51,67.58 46.59,66.5 47.25,66.5 v48.5,65.25
  Bottom 0.25: v48.5,65.25 48.5,64.5 49.12,63.88 49.12,30.24 47.66,28.77 47.66,27.88 48,27.54 48,19.34 v47.66,19 47.66,17.41 43.5,13.25 35.64,13.25 31.75,17.14 31.75,29.25 29.42,31.58 29.42,34.59 28.25,35.76 28.25,35.88 26.75,37.38 26.75,42.25 28.5,44 v28.75,44
DB1  (via drill 0.5)
  Top 0.2: v28.75,42.5 29.84,43.59 IC1.94
  Top 0.25: IC3.12 24.43,30.11 26.28,31.97 28.16,31.97 30,30.13 30,17.95 34.7,13.25 40.62,13.25 45.92,18.55 45.92,18.67 v46.25,19 | v47,65 46.58,65.33 46.58,65.45 45.2,66.83 44.42,66.83 42.92,68.33 41.94,68.33 40.44,69.83 39.42,69.83 38.82,70.43 P1.26
  Bottom 0.25: v47,65 47,64.75 48.38,63.38 48.38,30.55 46.91,29.09 46.91,27.57 47.25,27.23 47.25,21 46.25,20 v46.25,19 46.25,17.94 42.31,14 35.95,14 32.5,17.45 32.5,29.75 30.17,32.08 30.17,34.9 29,36.07 29,36.19 27.5,37.69 27.5,41.75 28.25,42.5 v28.75,42.5
DB2  (via drill 0.5)
  Top 0.2: IC1.98 29.74,41.99
  Top 0.25: IC3.13 24.64,31.39 25.97,32.72 28.47,32.72 30.75,30.44 30.75,18.26 35.01,14 39.96,14 44.52,18.55 44.52,18.67 v44.84,19 | v45.5,65 45.08,65.42 45.08,65.45 44.45,66.08 44.01,66.08 42.51,67.58 41.63,67.58 40.13,69.08 38.61,69.08 38.32,69.37 P1.25 | 29.74,41.99 v28.75,41
  Bottom 0.25: v45.5,65 45.5,64.75 47.62,62.62 47.62,30.86 46.16,29.4 46.16,27.26 46.5,26.92 46.5,21.31 44.84,19.65 v44.84,19 44.84,17.84 41.75,14.75 36.26,14.75 33.25,17.76 33.25,30.25 30.92,32.58 30.92,35.21 29.75,36.38 29.75,36.5 28.5,37.75 28.5,40.75 v28.75,41
DB3  (via drill 0.5)
  Top 0.2: IC1.99 30.84,41.59 29.75,40.5
  Top 0.25: IC3.15 13.56,33.31 14.25,34 28.25,34 31.5,30.75 31.5,18.57 35.32,14.75 39.31,14.75 43.11,18.55 43.11,18.67 v43.44,19 | v44,65 43.58,65.42 43.58,65.45 42.2,66.83 41.32,66.83 39.82,68.33 38.3,68.33 37.82,68.81 P1.24 | 29.75,40.5 v29.75,39.25
  Bottom 0.25: v44,65 44,64.75 46.88,61.88 46.88,31.18 45.41,29.71 45.41,26.95 45.75,26.61 45.75,21.62 43.44,19.31 v43.44,19 43.44,18.19 40.75,15.5 36.57,15.5 34,18.07 34,30.75 31.67,33.08 31.67,35.52 30.5,36.69 30.5,37.75 30.17,38.08 30.17,38.83 v29.75,39.25
DB4  (via drill 0.5)
  Top 0.2: IC1.100 31.44,41.19 31.25,41
  Top 0.25: IC3.16 11.87,31.39 11.25,32 11.25,34 12,34.75 28.56,34.75 32.25,31.06 32.25,18.88 35.63,15.5 38.87,15.5 41.7,18.33 41.7,18.67 v42.03,19 | v42.5,65 42.08,65.42 42.08,65.45 41.45,66.08 41.01,66.08 40.26,66.83 40.04,66.83 39.29,67.58 37.99,67.58 37.32,68.25 P1.23 | 31.25,41 v31.25,39
  Bottom 0.25: v42.5,65 42.5,64.81 46.12,61.19 46.12,31.49 44.66,30.02 44.66,26.64 45,26.3 45,22.09 42.36,19.45 42.36,19.33 v42.03,19 42.03,18.03 40.25,16.25 36.88,16.25 34.75,18.38 34.75,31.25 32.42,33.58 32.42,35.83 31.25,37 v31.25,39
DB5  (via drill 0.5)
  Top 0.2: IC1.3 36.88,38.13 36.25,37.5
  Top 0.25: IC3.17 13.29,30.39 11.8,30.39 10.5,31.69 10.5,34.31 11.69,35.5 28.87,35.5 33,31.37 33,19.19 35.94,16.25 38.56,16.25 40.25,17.94 40.25,18.63 v40.62,19 | v41,65 40.58,65.42 40.58,65.45 39.95,66.08 39.73,66.08 38.98,66.83 37.48,66.83 36.82,67.49 P1.22 | 36.25,37.5 v33.25,37.5
  Bottom 0.25: v41,65 41,64.75 45.38,60.38 45.38,31.8 43.91,30.33 43.91,26.33 44.25,25.98 44.25,22.4 41.93,20.08 41.58,20.08 40.95,19.45 40.95,19.33 v40.62,19 40.62,18.37 39.25,17 37.19,17 35.5,18.69 35.5,32 33.17,34.33 33.17,35.45 33.25,35.52 v33.25,37.5
DB6  (via drill 0.5)
  Top 0.2: IC1.4 37.28,37.28 37.25,37
  Top 0.25: IC3.18 13.29,29.11 12.01,29.11 9.75,31.38 9.75,34.62 11.38,36.25 29.18,36.25 33.75,31.68 33.75,19.5 36.25,17 38.25,17 39.17,17.92 v39.17,19 | P1.21 36.32,66.93 37.17,66.08 38.67,66.08 39.5,65.25 v39.5,65 | 37.25,37 35.25,35 v34.25,35
  Bottom 0.25: v34.25,35 34.25,34.5 36.25,32.5 36.25,19 37.5,17.75 38.94,17.75 39.22,18.03 39.17,18.08 v39.17,19 39.55,19.37 39.55,19.45 40.93,20.83 41.62,20.83 43.5,22.71 43.5,25.67 43.16,26.02 43.16,30.64 44.62,32.11 44.62,59.81 39.92,64.52 39.92,64.58 v39.5,65
DB7  (via drill 0.5)
  Top 0.2: IC1.5 37.68,36.18
  Top 0.25: IC3.19 13.29,27.84 12.22,27.84 9,31.07 9,34.93 11.07,37 29.49,37 34.5,31.99 | 34.5,31.99 34.5,19.81 36.56,17.75 37.25,17.75 37.77,18.27 v37.77,19 | P1.20 35.82,66.18 37,65 v38,65 | 37.68,36.18 35.75,34.25 35.75,33.24 34.5,31.99
  Bottom 0.25: v37.77,19 38.09,19.33 38.09,19.45 40.23,21.58 41.31,21.58 42.75,23.02 42.75,25.36 42.41,25.71 42.41,30.95 43.88,32.42 43.88,59 38.42,64.46 38.42,64.58 v38,65
DB8  (via drill 0.5)
  Top 0.2: IC1.90 27.69,45.19 23.5,41
  Top 0.25: P1.19 35.32,68.64 27.28,60.59 v25.25,60.59 IC2.11 | 23.5,41 18.25,41 17.25,40 v16.25,40
  Bottom 0.25: v16.25,40 13.27,42.98 13.27,55.42 11.5,57.19 11.5,66.03 14.05,68.58 16.7,68.58 18.83,66.45 18.83,62.98 21.05,60.75 24.69,60.75 24.84,60.59 v25.25,60.59
DB9  (via drill 0.5)
  Top 0.2: IC1.89 26.84,45.59 24.25,43
  Top 0.25: P1.18 34.82,69.2 27.49,61.87 v26,61.87 IC2.12 21.89,61.87 21.25,62.5 21.25,64 20.5,64.75 16.5,64.75 15.19,63.44 15.19,44.06 16.25,43 24.25,43
DB10  (via drill 0.5)
  Top 0.2: 24.25,44 26.25,46 26.26,45.99 IC1.88
  Top 0.25: IC2.13 v25.17,63.13 27.7,63.13 34.32,69.76 P1.17 | 24.25,44 16.31,44 15.94,44.37 15.94,62.94 16.75,63.75 19.75,63.75 v20,63.5
  Bottom 0.25: v20,63.5 24.78,63.5 v25.17,63.13
DB11  (via drill 0.5)
  Top 0.2: IC1.87 26.43,46.39 26.42,46.4 17.41,46.4 17.4,46.39
  Top 0.25: IC2.15 13.56,65.81 15.25,67.5 v16.25,67.5 24,67.5 24.75,68.25 31.75,68.25 33.82,70.32 P1.16 | 17.4,46.39 v17.01,46
  Bottom 0.25: v17.01,46 17.01,46.74 14.02,49.73 14.02,55.73 12.25,57.5 12.25,63.5 v16.25,67.5
DB12  (via drill 0.5)
  Top 0.2: IC1.79 35.84,49.59
  Top 0.25: IC2.16 12.57,63.13 11.94,63.77 11.94,65.25 15.27,68.58 v22.25,68.58 22.33,68.5 23.75,68.5 24.25,69 31.44,69 33.32,70.88 P1.15 | 35.84,49.59 36.25,50 36.25,50.79 35.35,51.68 35.35,51.9 34.75,52.5 v34.75,53.5
  Bottom 0.25: v22.25,68.58 22.12,68.75 22.12,71.25 23.75,72.88 25.88,72.88 27.5,71.25 27.5,69.06 32.27,64.3 32.27,60.61 33,59.87 33,59.63 36.38,56.26 36.38,55.12 v34.75,53.5
DB13  (via drill 0.5)
  Top 0.2: IC1.80 33.06,49.19 32.75,49.5
  Top 0.25: IC2.17 13.29,62.13 12.3,62.13 11.19,63.25 11.19,65.56 15.38,69.75 v23.25,69.75 31.13,69.75 32.82,71.44 P1.14 | 32.75,49.5 v32.75,55.75 | v27.38,64.25 27.38,66.19 27,66.56 26.5,66.56 v26,67.06
  Bottom 0.25: v27.38,64.25 27.12,64 27.12,59.94 26.88,59.69 26.88,57.81 28.88,55.81 32.69,55.81 v32.75,55.75 | v23.25,69.75 23.75,69.69 26,67.44 v26,67.06
DB14  (via drill 0.5)
  Top 0.2: 30.5,48.94 31.45,47.99 IC1.83
  Top 0.25: IC2.18 13.56,60.87 12.3,60.87 10.44,62.73 10.44,65.87 15.57,71 24,71 v24.25,70.75 24.5,70.5 30.82,70.5 32.32,72 P1.13 | v29.25,57.5 29.67,57.08 29.67,55.18 30.5,54.35 30.5,48.94 | v31.19,62.88 29.25,60.94 v29.25,60.69
  Bottom 0.25: v29.25,60.69 v29.25,57.5 | v31.19,62.88 31.19,64.31 24.88,70.62 24.38,70.62 v24.25,70.75
DB15  (via drill 0.5)
  Top 0.2: IC1.84 30.79,47.59 29.75,48.63
  Top 0.25: 9.69,62.21 12.3,59.59 13.56,59.59 IC2.19 | 9.69,62.21 9.69,66.18 15.51,72 25,72 v25.25,71.75 25.5,71.5 30.76,71.5 31.82,72.56 P1.12 | 29.75,49.25 29.75,48.63 | v28,58.25 28,55.79 29.75,54.04 29.75,49.25 | v38.25,22.56 38.31,22.56 40.69,20.19 48,20.19 48.75,19.44 48.75,18.5 43.5,13.25 43.12,13.25 41.62,11.75 v30.19,11.75 | 9.69,62.21 9.56,62.19 7.69,62.19 4.88,59.38 4.88,46.25 9.94,41.19 v11.44,41.19 | v29.25,49.75 29.75,49.25
  Bottom 0.25: v29.25,49.75 29.25,48.19 33.75,43.75 37.75,43.75 39.81,41.69 39.81,34.56 38.25,33 v38.25,22.56 | v30.19,11.75 28.88,11.75 14.06,26.56 14.06,38.56 v11.44,41.19
GND  (via drill 0.5)
  Top 0.2: IC1.31 54.44,43.19 | IC1.36 51.44,45.19 | IC1.65 40.08,56.37 | IC1.15 41.68,32.34
  Top 0.25: LED1.C 56.94,30.25 56.94,30.07 56.57,29.7 55.03,29.7 v54.79,29.46 | LED2.C 58.61,33.29 v58.74,33.42 | 40.08,56.37 C3.2 | P1.40 49.36,73.89 50.25,73 FET1.4 | 41.68,32.34 C1.2 | v18.86,76.5 18.86,78.61 19.25,79 26.25,79 26.82,78.43 P1.2 26.82,72.68 27,72.5 29.5,72.5 | P1.8 29.82,72.82 29.5,72.5 | P1.10 30.82,72.82 30.5,72.5 29.5,72.5
  other vias: 57.74,47.17 40.61,31.75 40.86,26.5 50.99,53.42 53.74,40.92 67.5,52 33.86,57 23.11,74 22.61,66.5 54.04,25.21 42.61,58.5 37.61,57.25 35.61,59.25 27.11,51.5 16.36,30.25 19.36,11.25 25.02,57.25 58.74,38.92 16.36,38.25 17.11,66 36,44.88 13.86,80.5 26.11,64.25 25.86,59.25
  pour Top: 3.86,3.81 3.86,28.39 2.25,30 2.25,64 3.86,65.61 3.86,84.74 77.44,84.74 77.44,70.56 79,69 79,58.25 77.5,56.75 77.44,3.81
  pour Bottom: 3.86,3.81 3.86,84.74 77.44,84.74 77.44,70.56 79,69 79,58.25 77.5,56.75 77.44,3.81
MISO
  Top 0.2: IC1.51 45.68,56.24 57.69,68.25
  Top 0.25: P3.6 72.19,63.29 72.28,63.29 73.15,64.16 73.15,67.38 72.28,68.25 57.69,68.25
MOSI
  Top 0.2: IC1.52 45.28,56.9
  Top 0.25: 45.28,56.9 57.38,69 72.59,69 73.9,67.69 73.9,62.91 71.77,60.77 P3.5
N$1
  Top 0.25: IC4.2 60.44,53.71 R2.2 | R1.1 R2.2 | C8.1 R2.2
N$2
  Top 0.2: IC1.21 44.08,37.17 50.42,30.83
  Top 0.25: R7.1 50.42,30.83
N$4
  Top 0.2: 43.68,36.32 IC1.20
  Top 0.25: R8.1 52.58,32.72 52.58,32.48 52.94,32.12 58.13,32.12 59,31.25 59,30 57,28 52,28 43.68,36.32
N$5
  Top 0.2: IC1.85 30.06,47.19 27.85,49.4
  Top 0.25: C6.1 27.85,49.4
N$6
  Top 0.2: 51.5,36.75 47.58,40.67 IC1.26
  Top 0.25: R9.1 51.5,36.75
N$7
  Top 0.2: IC1.27 48.66,41.59 51.04,39.21
  Top 0.25: R10.1 51.04,39.21
N$8
  Top 0.25: LED4.A R10.2
N$9
  Top 0.25: LED3.A R9.2
N$10
  Top 0.25: LED2.A R8.2
N$11
  Top 0.25: LED1.A R7.2
PGC
  Top 0.2: IC1.24 45.28,40.36 45.59,40.66
  Top 0.25: 45.59,40.66 46.04,40.66 46.41,40.3 46.41,39.91 51.06,35.25 59.14,35.25 60.55,33.83 60.55,31.08 ICSP1.5
PGD  (1 unrouted)
  Top 0.2: IC1.25 45.96,39.29
  Top 0.25: ICSP1.4 60.15,29.6 60.1,29.64 60.1,33.65 59,34.75 50.5,34.75 45.96,39.29
RAM_!CS  (via drill 0.5)
  Top 0.2: IC1.9 39.28,36.28 37.5,34.5
  Top 0.25: IC2.20 7.08,58.05 6.51,58.63 6.39,58.63 v6.06,58.96 | IC3.20 11.76,26.3 11.32,26.75 11.2,26.75 v10.87,27.08 | v55.5,17.25 53.72,19.03 53.72,19.47 50.69,22.5 41.22,22.5 37.5,26.22 37.5,34.5
  Bottom 0.25: v6.06,58.96 6.39,58.63 6.51,58.63 12.52,52.62 12.52,43.95 10.32,41.76 10.32,28.56 10.87,28.01 v10.87,27.08 11.2,26.75 11.32,26.75 16.45,21.62 16.45,13.51 16.12,13.18 16.12,10.55 20.43,6.25 57,6.25 58.25,7.5 58.25,16 57,17.25 v55.5,17.25
RST
  Top 0.25: R6.2 31.88,59.38 33.22,60.72 R5.2 33.31,60.88 34.98,60.88 C9.1
SCK
  Top 0.2: IC1.48 48.99,49.99
  Top 0.25: P3.7 60.08,64.77 49.81,54.5 49.81,50.81 48.99,49.99
VCC  (via drill 0.5)  (1 unrouted)
  Top 0.2: IC1.30 56.54,42.79 58.85,45.1 | IC1.46 45.44,49.19 | 46.16,45.59 IC1.37 50.59,45.59 55,50 | IC1.55 44.08,50.16 | 41.28,50.97 IC1.62 41.28,54.87 | 43.77,32.48 42.08,34.17 IC1.16 42.08,42.15 | 28.47,47.53 29.21,46.79 IC1.86 35.69,46.79 | 36.48,42.23 IC1.2
  Top 0.25: IC2.28 6.69,47.9 v6.06,47.38 | IC3.28 11.5,16.14 v10.87,15.82 | 58.85,45.1 C5.1 | 45.44,49.19 45.25,49 45.25,48.99 | 45.25,48.99 45.25,46.5 46.16,45.59 | 45.25,48.99 44.08,50.16 42.09,50.16 41.28,50.97 | C3.1 40.73,55.42 41.28,54.87 | C5.1 62.25,46 | C5.1 C4.1 58.85,49.4 58.25,50 55,50 | ICSP1.2 53.61,27.25 47.5,27.25 44.75,30 R4.1 44.03,31.68 C1.1 43.77,32.48 | 41.28,50.97 | 36.48,46 36.48,48.5 | 36.48,48.5 36.48,48.98 37,49.5 38.75,49.5 39,49.25 39.56,49.25 | C2.1 28.47,47.53 | v72.5,42.75 65.5,42.75 62.25,46 | 62.25,46 62.25,46.87 IC4.5 | P1.3 27.32,76.07 v28.25,77 | P1.34 42.82,82.68 41.75,83.75 v41.25,83.75 | 35.69,46.79 36.48,46 | R6.1 30,59.19 29.69,59.5 27.5,59.5 26.75,58.75 26.75,57.5 27.12,57.12 v27.12,54.88 | v36.38,48.5 36.48,48.5 | 41.28,50.97 39.56,49.25 | 36.48,46 37.17,45.31 37.17,42.92 36.48,42.23 | 42.08,42.15 40.17,44.05 40.17,48.64 39.56,49.25
  Bottom 0.25: v72.5,42.75 72,42.25 72,14.45 59.3,1.75 18.56,1.75 11.62,8.69 11.62,15.07 v10.87,15.82 10.54,16.14 10.42,16.14 4.32,22.25 4.32,44.24 6.06,45.98 v6.06,47.38 6,47.19 3.38,49.81 3.38,61.25 17.06,74.94 18.94,74.94 21,77 v28.25,77 29.44,77 36.44,84 41,84 v41.25,83.75 | v36.38,48.5 31.75,53.12 29.12,53.12 27.38,54.88 v27.12,54.88
XL  (via drill 0.5)
  Top 0.2: IC1.32 45.16,43.59
  Top 0.25: P1.38 44.82,84.57 v45.25,85 | 45.16,43.59 v41.25,47.5
  Bottom 0.25: v41.25,47.5 40.83,47.92 40.8,47.92 40.17,48.55 40.17,49.45 40.25,49.52 40.25,59.76 35.92,64.09 35.92,65.76 38.91,68.75 44,68.75 45.17,69.92 45.17,84.45 45.25,84.53 v45.25,85
XR  (via drill 0.5)
  Top 0.2: IC1.22 44.48,41.77 41.75,44.5
  Top 0.25: P1.36 43.82,83.18 42.25,84.75 v42.25,85 | 41.75,44.5 v41.25,44.5
  Bottom 0.25: v41.25,44.5 40.83,44.92 40.8,44.92 40.17,45.55 40.17,45.99 38.67,47.49 38.67,50.07 38.75,50.15 38.75,59.14 34.42,63.46 34.42,66.38 38.47,70.42 40.95,70.42 41.58,71.05 41.58,72.2 40.95,72.83 39.17,72.83 34.25,77.75 34.25,80 36.25,82 39.98,82 40.8,81.17 41.7,81.17 42.33,81.8 42.33,84.2 42.25,84.28 v42.25,85
YD  (via drill 0.5)
  Top 0.2: IC1.33 46.26,43.99 v41.25,49
  Top 0.25: P1.39 45.32,83.07 v46.25,84
  Bottom 0.25: v41.25,49 41.25,59.82 36.67,64.4 36.67,65.45 39.23,68 45.25,68 46.25,69 v46.25,84
YU  (via drill 0.5)
  Top 0.2: 44.88,42.62 IC1.23
  Top 0.25: P1.37 44.32,84.43 v43.75,85 | v41.25,46 41.5,46 44.88,42.62
  Bottom 0.25: v41.25,46 40.83,46.42 40.8,46.42 40.17,47.05 40.17,47.49 39.42,48.24 39.42,49.76 39.5,49.84 39.5,59.45 35.17,63.77 35.17,66.07 38.78,69.67 41.26,69.67 42.33,70.74 42.33,72.51 41.26,73.58 39.48,73.58 35.25,77.81 35.25,79.94 36.56,81.25 39.66,81.25 40.49,80.42 42.01,80.42 43.08,81.49 43.08,84.3 43.33,84.55 43.33,84.58 v43.75,85